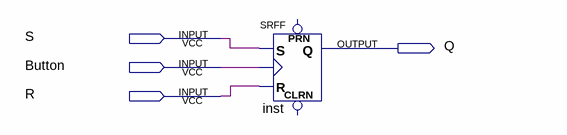
[diagram p0: schematic sheet]
// Quartus schematic scheme2.bdf as structural Verilog: 1 symbols, 4 pins
module scheme2 (
  input  S,
  input  Button,
  input  R,
  output Q
);

  SRFF inst (.S(S), .R(R), .CLK(Button), .Q(Q));  // open: PRN, CLRN
endmodule
